# EAGLE board core+io4 (EAGLE 6.6.0), part 1 of 2
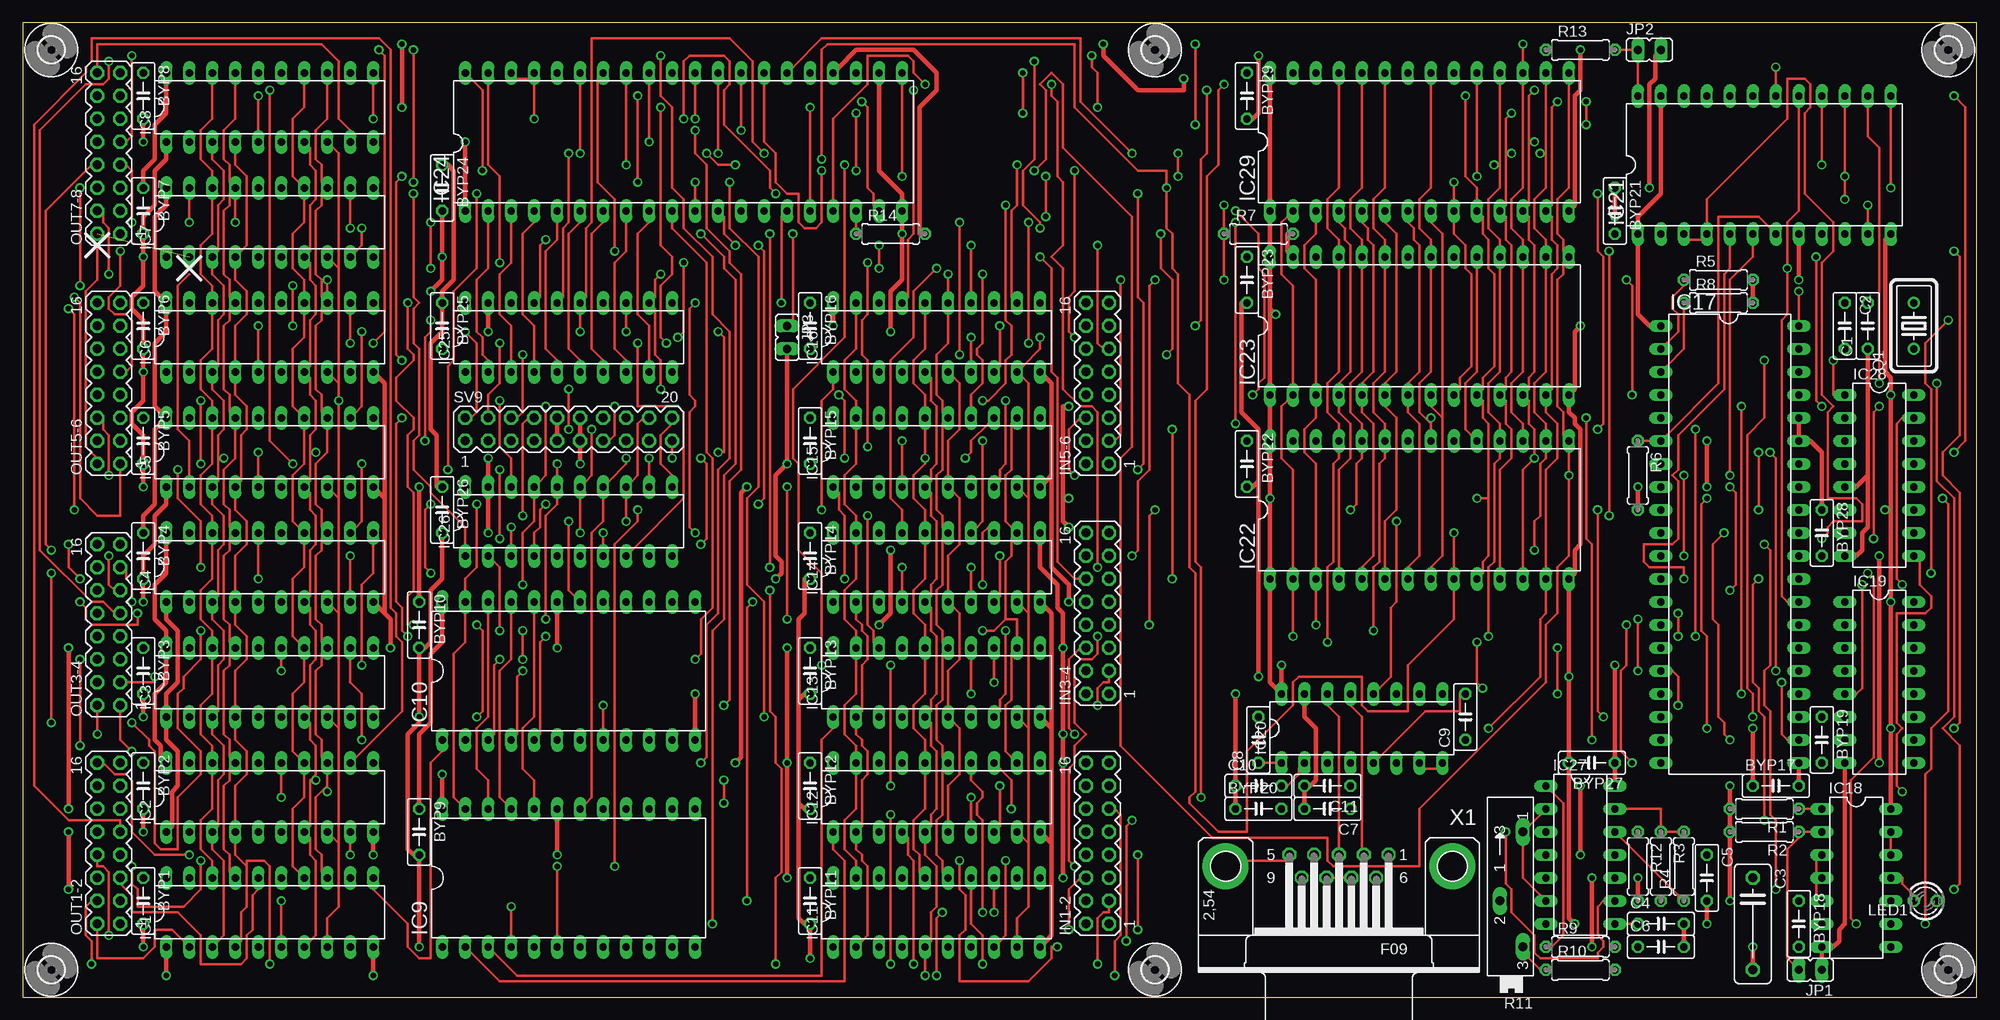
[diagram p3: board, top side]
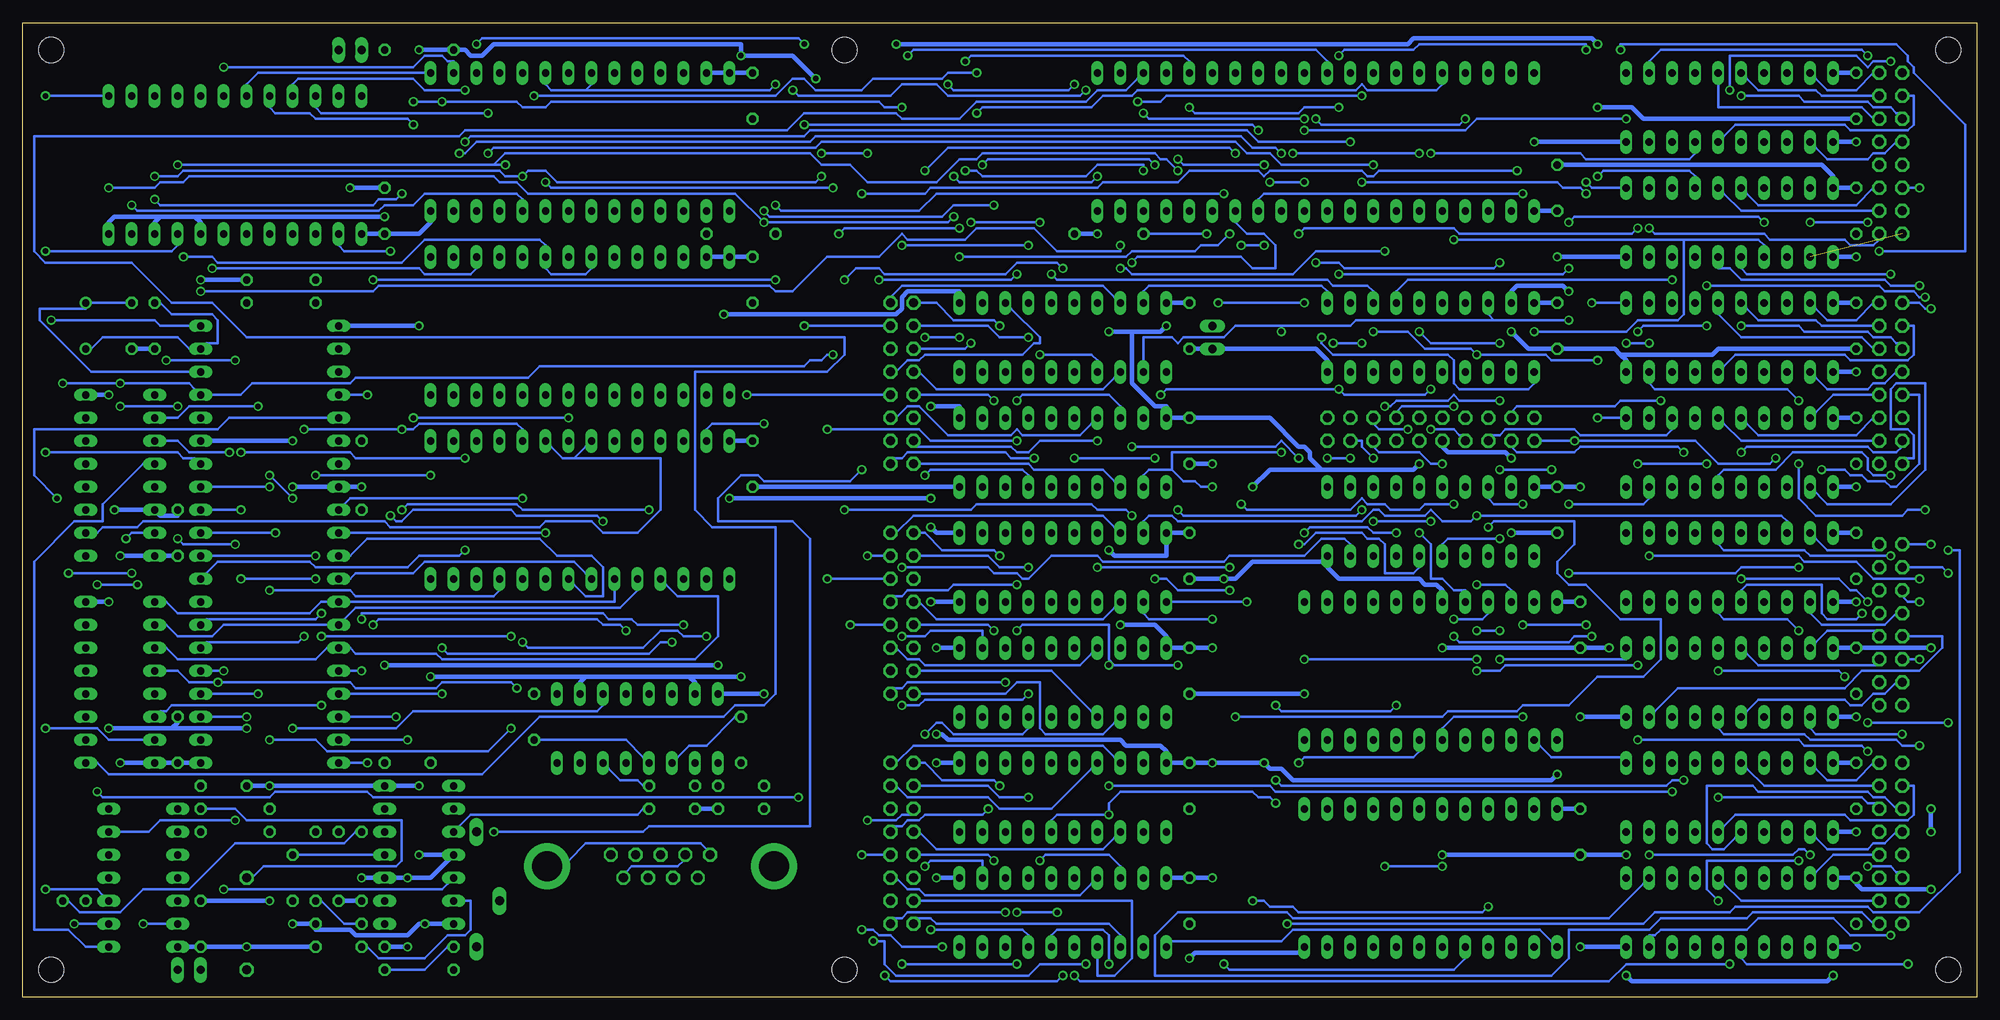
[diagram p4: board, bottom side, seen from below]

Size 215.88 x 107.62 mm. Coordinates in mm from the lower left corner, seen from the top.
Outline: 0,0 215.88,0 215.88,107.62 0,107.62 0,0
Copper layers (1*16): Top 0.035mm / dielectric 1.5mm / Bottom 0.035mm
Design rules "default": minimum track width 10mil, minimum drill 24mil, track to track 8mil, track to pad 8mil, pad to pad 8mil, via to via 8mil, smd to smd 8mil, copper to edge 40mil, drill to drill 8mil, minimum pad ring 10mil, minimum via ring 8mil, stop-mask expansion 4mil, vias tented up to drill 0mil, thermal gap 10mil
Net classes: 1 Power: width 0.508 mm, drill 0.254 mm, clearance 0.254 mm

## Footprints (pad centres in the part's own frame; a part is rotated, then mirrored left to right if it is on the bottom)
C050-025X075 = drill 0.813 octagon: 1 -2.54,0; 2 2.54,0
C102-043X133 = drill 1.016 octagon: 1 -5.08,0; 2 5.08,0
DIL20 = drill 0.813 long: 1 -11.43,-3.81; 2 -8.89,-3.81; 3 -6.35,-3.81; 4 -3.81,-3.81; 5 -1.27,-3.81; 6 1.27,-3.81; 7 3.81,-3.81; 8 6.35,-3.81; 9 8.89,-3.81; 10 11.43,-3.81; 11 11.43,3.81; 12 8.89,3.81; 13 6.35,3.81; 14 3.81,3.81; 15 1.27,3.81; 16 -1.27,3.81; 17 -3.81,3.81; 18 -6.35,3.81; 19 -8.89,3.81; 20 -11.43,3.81
DIL24-6 = drill 0.813 long: 1 -13.97,-7.62; 2 -11.43,-7.62; 3 -8.89,-7.62; 4 -6.35,-7.62; 5 -3.81,-7.62; 6 -1.27,-7.62; 7 1.27,-7.62; 8 3.81,-7.62; 9 6.35,-7.62; 10 8.89,-7.62; 11 11.43,-7.62; 12 13.97,-7.62; 13 13.97,7.62; 14 11.43,7.62; 15 8.89,7.62; 16 6.35,7.62; 17 3.81,7.62; 18 1.27,7.62; 19 -1.27,7.62; 20 -3.81,7.62; 21 -6.35,7.62; 22 -8.89,7.62; 23 -11.43,7.62; 24 -13.97,7.62
DIL40 = drill 0.813 long: 1 -24.13,-7.62; 2 -21.59,-7.62; 3 -19.05,-7.62; 4 -16.51,-7.62; 5 -13.97,-7.62; 6 -11.43,-7.62; 7 -8.89,-7.62; 8 -6.35,-7.62; 9 -3.81,-7.62; 10 -1.27,-7.62; 11 1.27,-7.62; 12 3.81,-7.62; 13 6.35,-7.62; 14 8.89,-7.62; 15 11.43,-7.62; 16 13.97,-7.62; 17 16.51,-7.62; 18 19.05,-7.62; 19 21.59,-7.62; 20 24.13,-7.62; 21 24.13,7.62; 22 21.59,7.62; 23 19.05,7.62; 24 16.51,7.62; 25 13.97,7.62; 26 11.43,7.62; 27 8.89,7.62; 28 6.35,7.62; 29 3.81,7.62; 30 1.27,7.62; 31 -1.27,7.62; 32 -3.81,7.62; 33 -6.35,7.62; 34 -8.89,7.62; 35 -11.43,7.62; 36 -13.97,7.62; 37 -16.51,7.62; 38 -19.05,7.62; 39 -21.59,7.62; 40 -24.13,7.62
DIL14 = drill 0.813 long: 1 -7.62,-3.81; 2 -5.08,-3.81; 3 -2.54,-3.81; 4 0,-3.81; 5 2.54,-3.81; 6 5.08,-3.81; 7 7.62,-3.81; 8 7.62,3.81; 9 5.08,3.81; 10 2.54,3.81; 11 0,3.81; 12 -2.54,3.81; 13 -5.08,3.81; 14 -7.62,3.81
DIL16 = drill 0.813 long: 1 -8.89,-3.81; 2 -6.35,-3.81; 3 -3.81,-3.81; 4 -1.27,-3.81; 5 1.27,-3.81; 6 3.81,-3.81; 7 6.35,-3.81; 8 8.89,-3.81; 9 8.89,3.81; 10 6.35,3.81; 11 3.81,3.81; 12 1.27,3.81; 13 -1.27,3.81; 14 -3.81,3.81; 15 -6.35,3.81; 16 -8.89,3.81
DIL24 = drill 0.813 long: 1 -13.97,-7.62; 2 -11.43,-7.62; 3 -8.89,-7.62; 4 -6.35,-7.62; 5 -3.81,-7.62; 6 -1.27,-7.62; 7 1.27,-7.62; 8 3.81,-7.62; 9 6.35,-7.62; 10 8.89,-7.62; 11 11.43,-7.62; 12 13.97,-7.62; 13 13.97,7.62; 14 11.43,7.62; 15 8.89,7.62; 16 6.35,7.62; 17 3.81,7.62; 18 1.27,7.62; 19 -1.27,7.62; 20 -3.81,7.62; 21 -6.35,7.62; 22 -8.89,7.62; 23 -11.43,7.62; 24 -13.97,7.62
DIL28 = drill 0.813 long: 1 -16.51,-7.62; 2 -13.97,-7.62; 3 -11.43,-7.62; 4 -8.89,-7.62; 5 -6.35,-7.62; 6 -3.81,-7.62; 7 -1.27,-7.62; 8 1.27,-7.62; 9 3.81,-7.62; 10 6.35,-7.62; 11 8.89,-7.62; 12 11.43,-7.62; 13 13.97,-7.62; 14 16.51,-7.62; 15 16.51,7.62; 16 13.97,7.62; 17 11.43,7.62; 18 8.89,7.62; 19 6.35,7.62; 20 3.81,7.62; 21 1.27,7.62; 22 -1.27,7.62; 23 -3.81,7.62; 24 -6.35,7.62; 25 -8.89,7.62; 26 -11.43,7.62; 27 -13.97,7.62; 28 -16.51,7.62
MA08-2 = drill 1.016 octagon: 1 -8.89,-1.27; 2 -8.89,1.27; 3 -6.35,-1.27; 4 -6.35,1.27; 5 -3.81,-1.27; 6 -3.81,1.27; 7 -1.27,-1.27; 8 -1.27,1.27; 9 1.27,-1.27; 10 1.27,1.27; 11 3.81,-1.27; 12 3.81,1.27; 13 6.35,-1.27; 14 6.35,1.27; 15 8.89,-1.27; 16 8.89,1.27
JP1 = drill 0.914 long: 1 0,-1.27; 2 0,1.27
LED3MM = drill 0.813 octagon: A -1.27,0; K 1.27,0
HC18U-V = drill 0.813: 1 -2.54,0; 2 2.54,0
0207/7 = drill 0.813 octagon: 1 -3.81,0; 2 3.81,0
SP19L = drill 1.016 long: A 5.715,-1.27; E -6.985,-1.27; S -1.905,1.27
MA10-2 = drill 1.016 octagon: 1 -11.43,-1.27; 2 -11.43,1.27; 3 -8.89,-1.27; 4 -8.89,1.27; 5 -6.35,-1.27; 6 -6.35,1.27; 7 -3.81,-1.27; 8 -3.81,1.27; 9 -1.27,-1.27; 10 -1.27,1.27; 11 1.27,-1.27; 12 1.27,1.27; 13 3.81,-1.27; 14 3.81,1.27; 15 6.35,-1.27; 16 6.35,1.27; 17 8.89,-1.27; 18 8.89,1.27; 19 11.43,-1.27; 20 11.43,1.27
2,8 = hole 2.8: 0,0
F09HP = drill 1.016 octagon: 1 -5.486,-1.27; 2 -2.743,-1.27; 3 0,-1.27; 4 2.743,-1.27; 5 5.486,-1.27; 6 -4.115,1.27; 7 -1.372,1.27; 8 1.372,1.27; 9 4.115,1.27 | drill 3.302 pad 5.08: G1 -12.522,0; G2 12.522,0

## Placement (x,y rotation side)
BYP1  .01uf  [C050-025X075]  13.33,10.63 270 top
BYP2  .01uf  [C050-025X075]  13.33,23.33 270 top
BYP3  .01uf  [C050-025X075]  13.33,36.03 270 top
BYP4  .01uf  [C050-025X075]  13.33,48.73 270 top
BYP5  .01uf  [C050-025X075]  13.33,61.43 270 top
BYP6  .01uf  [C050-025X075]  13.33,74.13 270 top
BYP7  .01uf  [C050-025X075]  13.33,86.83 270 top
BYP8  .01uf  [C050-025X075]  13.33,99.53 270 top
BYP9  .01uf  [C050-025X075]  43.81,18.25 270 top
BYP10  .01uf  [C050-025X075]  43.81,41.11 270 top
BYP11  .01uf  [C050-025X075]  86.99,10.63 270 top
BYP12  .01uf  [C050-025X075]  86.99,23.33 270 top
BYP13  .01uf  [C050-025X075]  86.99,36.03 270 top
BYP14  .01uf  [C050-025X075]  86.99,48.73 270 top
BYP15  .01uf  [C050-025X075]  86.99,61.43 270 top
BYP16  .01uf  [C050-025X075]  86.99,74.13 270 top
BYP17  .01uf  [C050-025X075]  193.67,23.33 0 top
BYP18  .01uf  [C050-025X075]  196.21,8.09 270 top
BYP19  .01uf  [C050-025X075]  198.75,28.41 270 top
BYP20  .01uf  [C050-025X075]  136.52,20.79 0 top
BYP21  .01uf  [C050-025X075]  175.89,86.83 270 top
BYP22  .01uf  [C050-025X075]  135.25,58.89 270 top
BYP23  .01uf  [C050-025X075]  135.25,79.21 270 top
BYP24  .01uf  [C050-025X075]  46.35,89.37 270 top
BYP25  .01uf  [C050-025X075]  46.35,74.13 270 top
BYP26  .01uf  [C050-025X075]  46.35,53.81 270 top
BYP27  .01uf  [C050-025X075]  173.35,25.87 180 top
BYP28  .01uf  [C050-025X075]  198.75,51.27 270 top
BYP29  .01uf  [C050-025X075]  135.25,99.53 270 top
C1  27pf  [C050-025X075]  203.83,74.13 90 top
C2  27pf  [C050-025X075]  201.29,74.13 270 top
C3  22uf  [C102-043X133]  191.13,8.09 270 top
C4  0.1uf  [C050-025X075]  180.97,8.09 0 top
C5  10uf  [C050-025X075]  186.05,13.17 270 top
C6  330pf  [C050-025X075]  180.97,5.55 0 top
C7  10uf  [C050-025X075]  144.14,20.79 180 top
C8  0.1uf  [C050-025X075]  136.52,28.41 90 top
C9  0.1uf  [C050-025X075]  159.38,30.95 90 top
C10  0.1uf  [C050-025X075]  136.52,23.33 0 top
C11  0.1uf  [C050-025X075]  144.14,23.33 180 top
IC1  74LS374N  [DIL20]  27.3,9.36 0 top
IC2  74LS374N  [DIL20]  27.3,22.06 0 top
IC3  74LS374N  [DIL20]  27.3,34.76 0 top
IC4  74LS374N  [DIL20]  27.3,47.46 0 top
IC5  74LS374N  [DIL20]  27.3,60.16 0 top
IC6  74LS374N  [DIL20]  27.3,72.86 0 top
IC7  74LS374N  [DIL20]  27.3,85.56 0 top
IC8  74LS374N  [DIL20]  27.3,98.26 0 top
IC9  74154N  [DIL24-6]  60.32,13.17 0 top
IC10  74154N  [DIL24-6]  60.32,36.03 0 top
IC11  74LS373N  [DIL20]  100.96,9.36 0 top
IC12  74LS373N  [DIL20]  100.96,22.06 0 top
IC13  74LS373N  [DIL20]  100.96,34.76 0 top
IC14  74LS373N  [DIL20]  100.96,47.46 0 top
IC15  74LS373N  [DIL20]  100.96,60.16 0 top
IC16  74LS373N  [DIL20]  100.96,72.86 0 top
IC17  [DIL40]  188.59,50 270 top
IC18  74LS00N  [DIL14]  202.56,13.17 270 top
IC19  74LS138N  [DIL16]  205.1,34.76 270 top
IC20  MAX232  [DIL16]  147.95,29.68 0 top
IC21  [DIL24]  192.4,91.91 0 top
IC22  5565  [DIL28]  154.3,53.81 0 top
IC23  2764  [DIL28]  154.3,74.13 0 top
IC24  [DIL40]  73.02,94.45 0 top
IC25  74LS245N  [DIL20]  60.32,72.86 0 top
IC26  74LS245N  [DIL20]  60.32,52.54 0 top
IC27  LM556N  [DIL14]  172.08,15.71 270 top
IC28  74LS138N  [DIL16]  205.1,57.62 270 top
IC29  2764  [DIL28]  154.3,94.45 0 top
IN1-2  [MA08-2]  118.74,16.98 90 top
IN3-4  [MA08-2]  118.74,42.38 90 top
IN5-6  [MA08-2]  118.74,67.78 90 top
JP1  RESET  [JP1]  197.48,3.01 90 top
JP2  DEBUG  [JP1]  179.7,104.61 270 top
JP3  CB1  [JP1]  84.45,72.86 180 top
LED1  [LED3MM]  210.18,10.63 180 top
OUT1-2  [MA08-2]  9.52,16.98 90 top
OUT3-4  [MA08-2]  9.52,41.11 90 top
OUT5-6  [MA08-2]  9.52,67.78 90 top
OUT7-8  [MA08-2]  9.52,93.18 90 top
Q1  4Mhz  [HC18U-V]  208.91,74.13 90 top
R1  10K  [0207/7]  192.4,20.79 180 top
R2  10K  [0207/7]  192.4,18.25 180 top
R3  100K  [0207/7]  180.97,14.44 270 top
R4  100K  [0207/7]  183.51,14.44 90 top
R5  3.3K  [0207/7]  187.32,79.21 0 top
R6  3.3K  [0207/7]  178.43,57.62 270 top
R7  3.3K  [0207/7]  136.52,84.29 0 top
R8  3.3K  [0207/7]  187.32,76.67 0 top
R9  1.8K  [0207/7]  172.08,5.55 0 top
R10  10K  [0207/7]  172.08,3.01 0 top
R11  10K  [SP19L]  164.46,12.54 90 top
R12  270  [0207/7]  178.43,14.44 270 top
R13  1K  [0207/7]  172.08,104.61 0 top
R14  3.3K  [0207/7]  95.88,84.29 0 top
SV9  [MA10-2]  60.32,62.7 0 top
U$1  [2,8]  125.09,3.01 0 top
U$2  [2,8]  125.09,104.61 0 top
U$3  [2,8]  3.17,104.61 0 top
U$4  [2,8]  3.17,3.01 0 top
U$5  [2,8]  212.72,104.61 0 top
U$6  [2,8]  212.72,3.01 0 top
X1  [F09HP]  145.41,14.44 180 top

## Tracks (layer width: path | path; a pad name or v marks a point on that pad's centre or on a via)
!AB
  Bottom 0.254: 154.94,59.52 153.66,60.8 IC22.22 | 154.94,59.52 156.2,59.52 157.47,60.8 IC22.20 | 154.94,59.52 145.41,59.52 145.41,53.81 147.95,51.27 151.76,51.27 153.03,52.54 158.11,52.54 158.75,51.91 175.25,51.91 175.89,52.54 202.56,52.54 203.19,51.91 207,51.91 207.64,51.27 IC28.10
!CD  (via drill 0.61)
  Top 0.254: v207.64,22.7 207,23.33 207,29.04 207.64,29.68 207,30.31 207,42.38 210.18,42.38 210.81,43.02 210.81,44.28 209.54,45.55 209.54,48.09 IC28.9 | v130.17,22.06 130.17,47.46 129.53,48.09 129.53,65.88 130.81,67.14 130.81,90.64 132.07,91.91 132.07,100.16 v132.71,100.8
  Bottom 0.254: 153.66,100.16 157.47,100.16 158.11,100.8 IC29.20 | 153.66,100.16 153.03,100.8 IC29.22 | v207.64,22.7 207,22.06 188.59,22.06 187.95,22.7 177.79,22.7 177.16,22.06 v130.17,22.06 | v132.71,100.8 133.34,100.16 153.66,100.16
!EF  (via drill 0.61)
  Top 0.254: v204.47,50.63 204.47,64.61 v205.1,65.24 | v198.75,65.24 198.12,65.88 v198.12,81.75
  Bottom 0.254: IC23.22 153.03,80.48 153.66,79.84 157.47,79.84 158.11,80.48 IC23.20 158.11,83.02 158.75,83.66 171.44,83.66 173.98,81.11 194.31,81.11 194.94,81.75 v198.12,81.75 | v204.47,50.63 203.83,51.27 202.56,51.27 IC28.7 | v205.1,65.24 v198.75,65.24
!HLT
  Top 0.254: IC17.2 181.6,72.22 182.88,73.5 182.88,75.4 182.24,76.03 182.24,77.3 183.51,78.58 R5.1
!IO-E
  Bottom 0.254: IC19.9 207.64,25.87 206.37,24.6 165.09,24.6 158.75,30.95 138.42,30.95 137.16,32.22 133.98,32.22 132.71,33.49 132.71,51.91 139.69,51.91 141.6,53.81 141.6,69.05 126.99,69.05 125.09,70.95 125.09,72.86 191.13,72.86 194.94,76.67 199.38,76.67 203.83,81.11 213.35,81.11 214.62,82.39 214.62,95.08 167.63,95.08 167,95.72 131.44,95.72 129.53,97.62 119.38,97.62 118.74,96.99 112.39,96.99 110.48,98.89 98.42,98.89 97.15,100.16 93.97,100.16 92.7,101.44 IC24.23
!IO-F  (via drill 0.61)
  Top 0.254: v213.35,82.39 213.99,81.75 213.99,62.06 212.09,60.16 212.09,57.62 213.99,55.71 213.99,30.31 v213.35,29.68
  Bottom 0.254: v213.35,82.39 199.38,82.39 198.75,83.02 IC21.9 | v213.35,29.68 207.64,29.68 206.37,28.41 202.56,28.41 IC19.7
!IRQ  (via drill 0.61)
  Top 0.254: IC24.38 54.61,101.44 55.88,101.44 IC24.37 56.51,100.8 v56.51,96.99 | v132.71,79.21 132.71,83.66 R7.1 132.71,84.92 v132.71,87.47 | v177.16,79.21 177.79,78.58 v177.79,66.51 | v73.02,96.99 73.02,103.34 73.66,103.97 77.46,103.97 78.1,103.34 78.1,100.8 77.46,100.16 77.46,96.36 82.55,91.28 82.55,89.37 v83.18,88.73
  Bottom 0.254: v177.16,79.21 v132.71,79.21 | v177.79,66.51 179.7,66.51 IC17.4 | v56.51,96.99 57.15,96.36 72.38,96.36 v73.02,96.99 | v83.18,88.73 114.93,88.73 116.83,86.83 132.07,86.83 v132.71,87.47
!NMI
  Top 0.254: R6.1 179.06,61.43 179.7,61.43 IC17.6 181.6,62.06 187.32,67.78 187.32,86.19 191.76,86.19 193.03,84.92 IC21.7
!RST  (via drill 0.61)
  Top 0.254: v212.72,74.77 210.18,72.22 210.18,67.78 210.81,67.14 v210.81,46.82 | v203.83,46.82 204.47,46.19 204.47,26.5 201.92,23.96 201.92,8.73 v202.56,8.09 | v65.4,82.39 65.4,88.1 63.5,90 63.5,101.44 IC24.34 | v94.61,83.02 v94.61,80.48 | v196.21,77.94 196.21,74.77 IC17.40
  Bottom 0.254: v212.72,74.77 201.29,74.77 200.66,74.13 197.48,74.13 IC17.40 | v210.81,46.82 v203.83,46.82 | v202.56,8.09 200.02,8.09 IC18.6 | v65.4,82.39 73.02,82.39 75.56,79.84 93.34,79.84 93.97,80.48 v94.61,80.48 | v94.61,83.02 94.61,82.39 101.59,82.39 104.13,84.92 110.48,84.92 111.75,83.66 118.1,83.66 118.74,84.29 121.28,81.75 126.99,81.75 130.81,77.94 132.71,77.94 133.34,78.58 176.53,78.58 177.16,77.94 v196.21,77.94
A00  (via drill 0.61)
  Top 0.254: 161.92,55.08 161.92,63.34 161.28,63.97 161.28,65.88 IC23.10 161.28,67.14 161.28,68.41 162.56,69.69 162.56,79.84 161.92,80.48 161.92,83.66 161.28,84.29 161.28,86.19 IC29.10 160.65,88.1 160.65,89.37 159.38,90.64 v159.38,99.53 | 161.92,55.08 161.92,48.73 161.28,48.09 161.28,46.82 IC22.10 | 161.92,55.08 v160.65,55.08 | v203.83,87.47 203.83,85.56 IC21.11 | v110.48,102.07 v110.48,97.62
  Bottom 0.254: v160.65,55.08 179.7,55.08 180.34,54.45 IC17.9 | v203.83,87.47 203.19,86.83 176.53,86.83 175.89,87.47 172.72,87.47 171.44,88.73 161.28,88.73 160.65,88.1 IC29.10 | v110.48,97.62 109.85,98.26 97.78,98.26 96.52,99.53 93.34,99.53 92.7,100.16 68.57,100.16 67.94,100.8 67.3,100.16 59.69,100.16 59.05,100.8 IC24.36 | v110.48,102.07 113.66,102.07 114.3,101.44 121.91,101.44 123.19,100.16 128.27,100.16 129.53,101.44 130.81,101.44 132.71,99.53 v159.38,99.53
A01  (via drill 0.61)
  Top 0.254: IC23.9 158.75,67.14 158.75,68.41 160.01,69.69 160.01,79.84 159.38,80.48 159.38,83.02 158.11,84.29 158.11,85.56 IC29.9 158.11,88.1 v158.11,90 | v158.11,51.27 158.11,47.46 IC22.9 158.11,44.92 158.11,41.74 153.03,36.66 153.03,31.58 148.59,31.58 147.95,32.22 147.95,35.39 140.97,35.39 140.33,34.76 140.33,32.22 135.25,27.14 135.25,18.25 132.07,18.25 128.9,21.42 128.9,22.06 129.53,22.7 129.53,46.82 128.9,47.46 128.9,66.51 127.63,67.78 127.63,79.84 126.99,80.48 126.99,84.29 126.36,84.92 v126.36,89.37 126.36,91.28 123.19,91.28 116.2,98.26 116.2,105.25 88.89,105.25 88.26,104.61 v88.26,92.55 | v61.59,93.18 61.59,100.8 IC24.35 | v75.56,93.18 76.83,91.91 v78.73,91.91
  Bottom 0.254: v158.11,51.27 179.7,51.27 IC17.10 | v75.56,93.18 v61.59,93.18 | v78.73,91.91 87.62,91.91 v88.26,92.55 | v158.11,90 157.47,89.37 v126.36,89.37
A02
  Top 0.254: 156.84,63.97 156.84,48.73 155.57,47.46 IC22.8 | 156.84,63.97 155.57,65.24 IC23.8 | 156.84,63.97 156.84,84.29 155.57,85.56 IC29.8
  Bottom 0.254: IC17.11 179.7,48.73 177.79,50.63 158.75,50.63 156.84,48.73 153.03,48.73 151.76,47.46 151.76,44.28 153.66,44.28 154.94,45.55 IC22.8
A03
  Top 0.254: IC22.7 153.03,47.46 154.3,48.73 154.3,63.34 153.03,64.61 153.03,65.24 IC23.7 153.03,67.78 154.3,69.05 154.3,83.02 153.66,83.66 153.66,84.92 153.03,85.56 IC29.7
  Bottom 0.254: IC17.12 179.7,46.19 179.06,46.82 172.72,46.82 171.44,48.09 154.94,48.09 153.66,46.82 IC22.7
A04
  Top 0.254: IC29.6 150.49,85.56 151.76,84.29 151.76,69.05 150.49,67.78 IC23.6 150.49,65.24 151.76,63.97 151.76,53.81 150.49,52.54 150.49,47.46 IC22.6
  Bottom 0.254: IC22.6 150.49,44.92 150.49,43.65 179.7,43.65 IC17.13 182.24,43.65 182.88,43.65 184.14,42.38 198.75,42.38 200.02,43.65 IC19.1
A05
  Top 0.254: IC22.5 147.95,47.46 149.22,48.73 149.22,63.34 147.95,64.61 147.95,65.24 IC23.5 147.95,67.78 149.22,69.05 149.22,83.02 148.59,83.66 148.59,84.92 147.95,85.56 IC29.5
  Bottom 0.254: IC19.2 200.02,41.11 198.75,39.84 194.94,39.84 193.67,41.11 182.24,41.11 IC17.14 180.34,41.74 179.06,43.02 149.85,43.02 147.95,44.92 IC22.5
A06
  Top 0.254: IC22.4 145.41,47.46 145.41,58.25 146.68,59.52 146.68,63.34 145.41,64.61 145.41,65.24 IC23.4 145.41,67.78 146.68,69.05 146.68,83.02 146.04,83.66 146.04,84.92 145.41,85.56 IC29.4
  Bottom 0.254: IC19.3 200.02,38.57 198.75,37.3 183.51,37.3 182.24,38.57 IC17.15 179.7,38.57 179.06,37.94 170.17,37.94 169.54,37.3 141.6,37.3 139.06,39.84 139.06,44.28 143.5,44.28 144.78,45.55 IC22.4
A07  (via drill 0.61)
  Top 0.254: v182.88,32.22 182.88,35.39 182.24,36.03 IC17.16 | IC29.3 142.87,85.56 142.87,84.29 141.6,83.02 141.6,80.48 142.87,79.21 142.87,67.78 IC23.3 142.87,65.24 142.87,63.97 141.6,62.7 141.6,60.16 142.87,58.89 142.87,47.46 IC22.3 142.87,44.92 v142.87,41.11 | v178.43,41.74 v178.43,36.03
  Bottom 0.254: v182.88,32.22 199.38,32.22 200.02,31.58 200.66,31.58 IC19.6 | v178.43,36.03 179.7,36.03 IC17.16 | v178.43,41.74 178.43,42.38 151.76,42.38 151.12,41.74 148.59,41.74 147.95,41.11 v142.87,41.11
A08  (via drill 0.61)
  Top 0.254: IC29.25 145.41,100.8 145.41,89.37 144.14,88.1 144.14,84.92 145.41,83.66 145.41,83.02 IC23.25 145.41,80.48 145.41,69.05 144.14,67.78 144.14,64.61 145.41,63.34 145.41,62.7 IC22.25 145.41,60.16 145.41,59.52 144.78,58.89 144.78,48.09 144.14,47.46 v144.14,39.2 | v169.54,38.57 v169.54,33.49
  Bottom 0.254: v169.54,33.49 179.7,33.49 IC17.17 | v169.54,38.57 168.91,37.94 146.68,37.94 145.41,39.2 v144.14,39.2
A09  (via drill 0.61)
  Top 0.254: IC29.24 147.95,100.8 147.95,89.37 146.68,88.1 146.68,84.92 147.95,83.66 147.95,83.02 IC23.24 147.95,80.48 147.95,69.05 146.68,67.78 146.68,64.61 147.95,63.34 147.95,62.7 IC22.24 147.95,60.16 147.95,59.52 147.31,58.89 147.31,54.45 v146.68,53.81 | v174.62,30.95 173.98,31.58 v173.98,53.81
  Bottom 0.254: v174.62,30.95 179.7,30.95 IC17.18 | v173.98,53.81 173.35,54.45 161.28,54.45 160.65,53.81 v146.68,53.81
A10  (via drill 0.61)
  Top 0.254: 155.57,63.34 154.3,64.61 154.3,67.78 155.57,69.05 155.57,80.48 IC23.21 155.57,83.02 155.57,83.66 154.3,84.92 154.3,88.1 155.57,89.37 155.57,100.8 IC29.21 | 155.57,63.34 155.57,62.7 IC22.21 | v173.35,28.41 173.35,50 172.72,50.63 v172.72,63.97 | 155.57,63.34 v155.57,63.97
  Bottom 0.254: v173.35,28.41 179.7,28.41 IC17.19 | v155.57,63.97 v172.72,63.97
A11  (via drill 0.61)
  Top 0.254: IC29.23 150.49,100.8 150.49,89.37 149.22,88.1 149.22,84.92 150.49,83.66 150.49,83.02 IC23.23 150.49,80.48 150.49,69.05 149.22,67.78 149.22,64.61 150.49,63.34 150.49,62.7 IC22.23 150.49,60.16 150.49,59.52 149.85,58.89 149.85,48.09 149.22,47.46 v149.22,40.48 | v177.79,25.87 176.53,27.14 176.53,36.03 177.16,36.66 v177.16,41.11
  Bottom 0.254: v177.79,25.87 179.7,25.87 IC17.20 | v177.16,41.11 176.53,41.74 152.39,41.74 151.76,41.11 149.85,41.11 v149.22,40.48
A12  (via drill 0.61)
  Top 0.254: v194.31,34.76 194.31,29.04 194.94,28.41 IC17.22 | IC29.2 139.69,86.19 139.06,85.56 139.06,79.84 140.33,78.58 140.33,67.78 IC23.2 139.69,65.88 139.06,65.24 139.06,59.52 140.33,58.25 140.33,47.46 IC22.2 140.33,44.92 v140.33,39.84 | v161.28,34.12 160.65,34.76 v160.65,39.2
  Bottom 0.254: IC19.4 200.02,36.03 198.75,36.03 197.48,34.76 v194.31,34.76 179.7,34.76 179.06,34.12 170.17,34.12 169.54,34.76 161.92,34.76 v161.28,34.12 | v160.65,39.2 160.01,38.57 147.31,38.57 145.41,40.48 143.5,40.48 142.87,39.84 v140.33,39.84
A13  (via drill 0.61)
  Top 0.254: v191.13,30.95 191.13,33.49 190.5,34.12 190.5,62.06 192.4,63.97 v192.4,70.32 | v200.02,70.32 200.02,66.51 IC28.1
  Bottom 0.254: v191.13,30.95 194.94,30.95 IC17.23 | v192.4,70.32 v200.02,70.32
A14  (via drill 0.61)
  Top 0.254: v189.86,65.24 v189.86,33.49
  Bottom 0.254: v189.86,33.49 194.94,33.49 IC17.24 | v189.86,65.24 197.48,65.24 198.75,63.97 200.02,63.97 IC28.2
A15  (via drill 0.61)
  Top 0.254: v193.67,36.03 193.67,59.52 v193.03,60.16
  Bottom 0.254: v193.67,36.03 194.94,36.03 IC17.25 | v193.03,60.16 197.48,60.16 198.75,61.43 200.02,61.43 IC28.3
CB1  (via drill 0.61)
  Top 0.254: IC24.18 92.07,85.56 92.07,84.92 R14.1 | v85.08,84.29 85.08,74.77 JP3.1
  Bottom 0.254: v85.08,84.29 91.44,84.29 R14.1
D0  (via drill 0.61)
  Top 0.254: IC22.11 163.19,47.46 163.19,58.25 164.46,59.52 164.46,62.7 163.82,63.34 163.82,65.88 IC23.11 163.82,67.14 163.82,68.41 164.46,69.05 164.46,83.02 163.82,83.66 163.82,86.19 IC29.11 163.82,87.47 163.82,93.18 | v164.46,97.62 163.82,96.99 163.82,93.18 | v66.67,91.91 66.67,100.8 IC24.33 | v164.46,93.18 163.82,93.18 | v188.59,56.35 189.22,55.71 189.22,45.55 v188.59,44.92
  Bottom 0.254: v164.46,97.62 182.88,97.62 183.51,98.26 IC21.22 | v66.67,91.91 76.83,91.91 78.1,93.18 80.64,93.18 81.91,94.45 127.63,94.45 128.27,93.81 163.82,93.81 v164.46,93.18 | v188.59,56.35 194.94,56.35 IC17.33 | v188.59,44.92 179.7,44.92 179.06,44.28 163.82,44.28 163.19,44.92 IC22.11
D1  (via drill 0.61)
  Top 0.254: IC22.12 165.73,47.46 165.73,58.25 v167,59.52 167,62.7 166.37,63.34 166.37,65.88 IC23.12 166.37,67.14 166.37,68.41 167,69.05 167,83.02 166.37,83.66 166.37,86.19 IC29.12 166.37,87.47 166.37,94.45 | v167,100.16 166.37,99.53 166.37,94.45 | v69.21,94.45 69.21,100.8 IC24.32 | v167,94.45 166.37,94.45 | v191.76,60.16 v191.76,53.81
  Bottom 0.254: v167,100.16 171.44,100.16 172.72,101.44 185.41,101.44 186.05,100.8 IC21.21 | v69.21,94.45 79.37,94.45 80.64,95.72 128.9,95.72 129.53,95.08 166.37,95.08 v167,94.45 | v191.76,53.81 194.94,53.81 IC17.32 | v191.76,60.16 179.7,60.16 179.06,59.52 v167,59.52
D2  (via drill 0.61)
  Top 0.254: v172.72,98.89 v172.72,96.36 | v169.54,98.89 168.91,98.26 168.91,87.47 IC29.13 168.91,86.19 168.91,83.66 169.54,83.02 169.54,80.48 168.91,79.84 168.91,67.14 IC23.13 168.27,65.24 168.27,64.61 169.54,63.34 169.54,59.52 168.27,58.25 168.27,47.46 IC22.13 168.27,44.92 168.27,42.38 167.63,41.74 167.63,35.39 v161.92,29.68 | v118.1,103.97 118.1,102.7 118.74,102.07 v118.74,98.26 | v187.95,51.27 186.69,50 186.69,41.74 187.32,41.11 187.32,30.95 187.95,30.31 187.95,29.04 v188.59,28.41
  Bottom 0.254: v172.72,96.36 173.35,96.99 183.51,96.99 184.14,97.62 187.95,97.62 188.59,98.26 IC21.20 | v172.72,98.89 v169.54,98.89 161.28,98.89 160.65,98.26 158.11,98.26 157.47,98.89 121.28,98.89 120.64,98.26 v118.74,98.26 | v118.1,103.97 117.47,104.61 73.02,104.61 71.75,103.34 IC24.31 | v187.95,51.27 194.94,51.27 IC17.31 | v188.59,28.41 183.51,28.41 182.24,27.14 164.46,27.14 v161.92,29.68
D3  (via drill 0.61)
  Top 0.254: v74.29,96.99 74.29,100.8 IC24.30 | v92.07,91.28 v92.07,97.62 | v111.75,91.28 113.02,92.55 113.02,100.16 112.39,100.8 113.66,102.07 114.93,100.8 114.93,93.81 122.55,86.19 122.55,60.8 121.28,59.52 121.28,27.77 131.44,17.61 144.14,17.61 144.14,15.08 144.78,14.44 154.3,14.44 154.3,20.79 168.27,34.76 168.27,41.11 169.54,42.38 169.54,47.46 170.81,48.73 v170.81,57.62 170.81,60.16 IC22.15 170.17,62.06 170.17,64.61 169.54,65.24 169.54,79.21 170.17,79.84 170.17,81.11 IC23.15 170.17,82.39 170.17,83.66 169.54,84.29 169.54,88.1 170.81,89.37 170.81,100.8 IC29.15 | v183.51,57.62 v183.51,48.73
  Bottom 0.254: IC29.15 171.44,102.07 189.86,102.07 191.13,100.8 IC21.19 | v74.29,96.99 91.44,96.99 v92.07,97.62 | v92.07,91.28 92.07,91.91 97.15,91.91 98.42,90.64 109.85,90.64 110.48,91.28 v111.75,91.28 | v183.51,48.73 194.94,48.73 IC17.30 | v170.81,57.62 v183.51,57.62
D4  (via drill 0.61)
  Top 0.254: 168.27,93.18 168.27,89.37 167,88.1 167,84.92 168.27,83.66 168.27,83.02 IC23.16 168.27,80.48 168.27,69.05 167,67.78 167,64.61 168.27,63.34 168.27,62.7 IC22.16 168.27,60.16 168.27,59.52 167.63,58.89 167.63,53.17 167,52.54 v167,49.37 | 168.27,93.18 168.27,100.8 IC29.16 | v193.67,102.7 193.67,100.8 IC21.18 | v76.83,93.18 76.83,100.8 IC24.29 | v167.63,93.18 168.27,93.18
  Bottom 0.254: v193.67,102.7 172.72,102.7 171.44,103.97 169.54,103.97 168.91,103.34 168.27,103.34 IC29.16 | v76.83,93.18 77.46,93.81 80,93.81 81.27,95.08 128.27,95.08 128.9,94.45 165.73,94.45 167,93.18 v167.63,93.18 | v167,49.37 167.63,48.73 172.08,48.73 173.35,47.46 183.51,47.46 184.14,48.09 194.31,48.09 195.57,46.82 IC17.29
D5  (via drill 0.61)
  Top 0.254: IC21.17 196.21,98.26 196.21,86.83 194.94,85.56 v194.94,80.48 194.94,75.4 194.31,74.77 194.31,44.28 194.94,43.65 IC17.28 | IC22.17 165.73,62.7 165.73,63.34 164.46,64.61 164.46,67.78 165.73,69.05 165.73,80.48 IC23.17 165.73,83.02 165.73,83.66 164.46,84.92 164.46,88.1 165.73,89.37 165.73,100.8 IC29.17 165.73,103.34 v165.73,105.25 | v79.37,95.72 79.37,100.8 IC24.28 | v129.53,105.25 v129.53,96.36
  Bottom 0.254: v79.37,95.72 80,96.36 v129.53,96.36 | v129.53,105.25 130.17,105.88 165.09,105.88 v165.73,105.25 | v194.94,80.48 172.08,80.48 171.44,79.84 166.37,79.84 165.73,80.48 IC23.17
D6  (via drill 0.61)
  Top 0.254: 163.19,91.91 163.19,89.37 161.92,88.1 161.92,84.92 163.19,83.66 163.19,83.02 IC23.18 163.19,80.48 163.19,69.05 161.92,67.78 161.92,64.61 163.19,63.34 163.19,62.7 IC22.18 163.19,60.16 163.19,59.52 162.56,58.89 162.56,48.09 161.92,47.46 v161.92,39.84 | 163.19,91.91 163.19,100.8 IC29.18 | v182.88,39.84 v182.88,42.38 | v198.75,91.91 198.75,98.26 IC21.16 | v162.56,91.91 163.19,91.91 | v88.26,91.28 88.26,85.56 87.62,84.92 86.35,84.92 85.72,85.56 85.72,88.73 84.45,88.73 83.18,90 83.18,93.18 81.91,94.45 81.91,100.8 IC24.27
  Bottom 0.254: v182.88,42.38 183.51,41.74 195.57,41.74 IC17.27 | v161.92,39.84 v182.88,39.84 | 163.82,91.91 v162.56,91.91 | 163.82,91.91 v198.75,91.91 | v88.26,91.28 89.53,92.55 90.16,92.55 90.8,93.18 109.85,93.18 110.48,92.55 112.39,92.55 114.93,90 122.55,90 124.45,91.91 127.63,91.91 128.9,93.18 162.56,93.18 163.82,91.91
D7  (via drill 0.61)
  Top 0.254: IC22.19 160.01,62.06 159.38,62.7 159.38,67.78 160.65,69.05 160.65,80.48 IC23.19 | v184.78,62.7 v184.78,39.84 | v160.65,90.64 160.65,100.8 IC29.19 | IC21.15 201.29,98.26 v201.29,90.64 v201.29,88.1 | v122.55,93.18 116.83,98.89 116.83,105.88 88.26,105.88 85.08,102.7 IC24.26 | v127.63,90.64 v127.63,93.18 | v173.98,62.7 174.62,63.34 174.62,81.75 173.98,82.39 v173.98,88.73
  Bottom 0.254: v184.78,39.84 185.41,39.2 195.57,39.2 IC17.26 | v184.78,62.7 v173.98,62.7 172.72,62.7 172.08,63.34 161.28,63.34 160.65,62.7 IC22.19 | v201.29,90.64 198.75,90.64 198.12,91.28 163.19,91.28 162.56,90.64 v160.65,90.64 160.01,91.28 158.11,91.28 156.84,90 128.27,90 v127.63,90.64 | v127.63,93.18 v122.55,93.18 | v173.98,88.73 174.62,88.1 176.53,88.1 177.16,87.47 200.66,87.47 v201.29,88.1
E  (via drill 0.61)
  Top 0.254: v205.1,67.78 205.1,93.81 203.83,95.08 203.83,98.26 IC21.14 | v111.75,103.34 111.75,92.55 110.48,91.28 110.48,87.47 112.39,85.56 v112.39,84.92 | v125.72,84.29 125.72,80.48 126.99,79.21 126.99,71.59 v126.36,70.95 | v213.35,11.9 213.99,12.54 213.99,27.77 212.09,29.68 213.35,30.95 213.35,55.08 211.45,56.98 v211.45,67.78
  Bottom 0.254: v111.75,103.34 111.12,103.97 87.62,103.97 86.99,103.34 IC24.25 | v112.39,84.92 125.09,84.92 v125.72,84.29 | v126.36,70.95 126.99,70.95 127.63,70.32 128.9,70.32 129.53,69.69 158.75,69.69 160.01,68.41 179.06,68.41 179.7,67.78 190.5,67.78 191.76,66.51 194.94,66.51 IC17.37 196.84,67.14 197.48,67.78 v205.1,67.78 v211.45,67.78 | v213.35,11.9 207.64,11.9 207,11.27 IC18.10
GND  (via drill 0.61)
  Top 0.508: JP3.2 84.45,70.95 v84.45,58.89 83.18,57.62 83.18,48.73 83.81,48.09 83.81,46.82 v83.18,46.19 | v86.99,4.28 86.99,7.46 BYP11.2 86.35,8.09 85.72,8.73 85.72,21.42 | 85.72,21.42 86.35,20.79 BYP12.2 | 85.72,32.85 85.72,21.42 | 85.72,32.85 86.35,33.49 BYP13.2 | v74.29,33.49 74.29,29.68 IC10.12 | 85.72,32.85 85.72,41.74 86.35,42.38 86.35,46.19 BYP14.2 | v13.33,5.55 13.33,7.46 BYP1.2 | v43.81,5.55 43.81,15.08 BYP9.2 43.18,15.71 42.54,16.34 42.54,29.04 43.81,30.31 v43.81,30.95 43.81,37.94 BYP10.2 44.45,38.57 45.08,39.2 45.08,44.92 46.35,46.19 46.35,50.63 BYP26.2 | v38.73,15.71 38.73,16.98 IC2.10 | v59.05,15.71 59.05,19.52 IC9.19 | v15.87,2.38 15.87,4.28 IC1.1 | v38.73,2.38 38.73,4.28 IC1.10 | v13.33,18.25 13.33,20.15 BYP2.2 | v13.33,30.95 13.33,32.85 BYP3.2 | IC2.1 16.5,18.88 16.5,22.7 17.14,23.33 17.14,27.14 15.87,28.41 15.87,29.68 IC3.1 15.87,32.22 15.87,33.49 17.14,34.76 17.14,40.48 15.87,41.74 15.87,42.38 IC4.1 | v13.33,43.65 13.33,45.55 BYP4.2 13.33,46.82 13.33,48.73 14.6,50 14.6,53.17 15.87,54.45 15.87,55.08 IC5.1 | v13.33,56.35 13.33,58.25 BYP5.2 13.33,59.52 13.33,62.06 12.06,63.34 12.06,64.61 13.33,65.88 v13.33,69.05 13.33,70.95 BYP6.2 13.33,72.22 13.33,74.77 12.06,76.03 12.06,77.3 13.33,78.58 v13.33,81.75 13.33,83.66 BYP7.2 13.33,84.92 13.33,86.19 14.6,87.47 14.6,91.28 15.87,92.55 15.87,93.18 IC8.1 | v13.33,94.45 13.33,96.36 BYP8.2 | SV9.9 59.05,62.06 59.05,63.34 SV9.10 | v51.43,51.27 51.43,55.08 IC26.19 51.43,57.62 v51.43,59.52 | BYP24.2 46.35,86.19 v46.35,81.75 46.35,79.21 v45.08,77.94 | v48.89,94.45 48.89,88.1 IC24.1 | v51.43,73.5 51.43,75.4 IC25.19
  Top 0.508: 40,42.38 40.64,41.74 v40.64,38.57 | 40,42.38 39.37,43.02 IC4.10 | v59.05,38.57 59.05,42.38 IC10.19 | 40,55.08 39.37,55.71 IC5.10 | 40,55.08 40,42.38 | 40,55.08 40,67.78 39.37,68.41 IC6.10 | 113.66,16.98 113.66,6.82 113.02,6.18 IC11.10 | 113.66,16.98 113.02,17.61 IC12.10 | 113.66,29.68 113.02,30.31 IC13.10 | 113.66,29.68 113.66,16.98 | 113.66,29.68 113.66,42.38 113.02,43.02 IC14.10 | 113.66,57.62 113.02,56.98 IC15.10 | 113.66,57.62 113.66,67.78 113.02,68.41 IC16.10 | 136.52,56.98 136.52,62.7 134.62,64.61 134.62,76.67 BYP23.2 | 136.52,56.98 135.88,56.35 BYP22.2 | v115.56,43.65 115.56,45.55 113.66,47.46 113.66,57.62 | C6.2 183.51,6.18 183.51,7.46 C4.2 | v186.05,8.09 186.05,10 C5.2 | JP1.1 198.75,4.28 198.75,4.92 IC18.7 200.02,5.55 200.66,6.18 200.66,7.46 201.29,8.09 201.29,25.23 IC19.8 | v191.13,5.55 191.13,3.64 C3.2 | BYP17.2 196.21,23.96 196.21,25.23 IC17.21 | 203.83,57.62 202.56,56.35 IC28.5 | 203.83,57.62 203.83,70.95 C1.1 | 203.83,57.62 203.83,51.91 203.19,51.27 203.19,49.37 202.56,48.73 IC28.8 | v205.1,25.87 v205.1,48.73 | C7.2 141.6,21.42 141.6,22.7 C11.2 142.23,23.33 142.87,23.96 142.87,29.68 141.6,30.95 141.6,32.22 IC20.15 | v171.44,8.09 170.81,8.73 170.81,25.23 BYP27.2 170.81,26.5 v170.81,35.39 170.81,44.92 IC22.14 171.44,46.82 171.44,49.37 172.08,50 172.08,62.7 171.44,63.34 171.44,63.97 170.81,64.61 170.81,65.24 IC23.14 171.44,67.14 171.44,73.5 v172.08,74.13 | v136.52,103.97 136.52,97.62 135.88,96.99 BYP29.2 | IC21.23 180.97,98.26 180.97,88.73 178.43,86.19 178.43,85.56 IC21.1 178.43,83.02 178.43,75.4 179.7,74.13 IC17.1 | v172.08,104.61 172.08,100.16 171.44,99.53 171.44,87.47 IC29.14
  Top 0.508: v136.52,35.39 136.52,56.98 | v41.91,105.25 v41.91,98.26 | v119.38,105.25 119.38,103.97 123.19,100.16 128.27,100.16 v128.27,101.44
  Bottom 0.508: v84.45,58.89 86.35,58.89 BYP15.2 | IC25.10 71.75,70.32 73.02,71.59 83.18,71.59 JP3.2 85.72,71.59 86.35,71.59 BYP16.2 | v86.99,4.28 86.35,4.92 74.92,4.92 IC9.12 | v74.29,33.49 86.35,33.49 BYP13.2 | BYP14.2 86.35,46.19 v83.18,46.19 81.91,46.19 80,48.09 72.38,48.09 IC26.10 71.75,47.46 70.48,46.19 61.59,46.19 60.96,45.55 59.69,45.55 59.05,44.92 IC10.19 | v13.33,5.55 15.24,5.55 IC1.1 | v43.81,5.55 39.37,5.55 IC1.10 | v38.73,15.71 43.18,15.71 BYP9.2 44.45,15.71 v59.05,15.71 | v15.87,2.38 16.5,1.74 38.1,1.74 v38.73,2.38 | v13.33,18.25 15.24,18.25 IC2.1 | v13.33,30.95 15.24,30.95 IC3.1 | v13.33,43.65 15.24,43.65 IC4.1 | v13.33,56.35 15.24,56.35 IC5.1 | v13.33,94.45 15.24,94.45 IC8.1 | v13.33,69.05 15.24,69.05 IC6.1 | v13.33,81.75 15.24,81.75 IC7.1 | v51.43,51.27 46.98,51.27 BYP26.2 | v51.43,59.52 52.07,60.16 58.41,60.16 59.05,60.8 SV9.9 | v46.35,81.75 39.37,81.75 IC7.10 | IC24.1 48.26,86.83 46.98,86.83 BYP24.2 | v48.89,94.45 39.37,94.45 IC8.10 | 39.37,70.95 40,71.59 45.72,71.59 BYP25.2 46.98,71.59 49.53,71.59 v51.43,73.5 | 39.37,70.95 38.73,70.32 IC6.10 | v43.81,30.95 39.37,30.95 IC3.10 | v40.64,38.57 43.18,38.57 BYP10.2 44.45,38.57 v59.05,38.57 | v45.08,77.94 45.72,78.58 50.8,78.58 51.43,77.94 IC25.19 | 39.37,70.95 29.2,70.95 28.57,71.59 13.97,71.59 BYP6.2 | BYP22.2 134.62,56.35 113.02,56.35 IC15.10 | v115.56,43.65 113.02,43.65 IC14.10 | v186.05,8.09 184.14,8.09 C4.2 183.51,7.46 179.7,7.46 179.06,6.82 173.35,6.82 172.08,8.09 v171.44,8.09 169.54,8.09 IC27.7 | IC18.7 197.48,5.55 196.84,5.55 BYP18.2 195.57,5.55 v191.13,5.55 184.14,5.55 C6.2 | IC17.21 197.48,25.87 198.12,25.87 BYP19.2 199.38,25.87 200.02,25.87 IC19.8 202.56,25.87 v205.1,25.87
  Bottom 0.508: BYP28.2 199.38,48.73 200.02,48.73 IC28.8 202.56,48.73 v205.1,48.73 | C2.2 201.92,71.59 203.19,71.59 C1.1 | BYP20.2 139.69,20.79 140.97,20.79 C7.2 | 142.23,35.39 141.6,34.76 IC20.15 | 153.66,35.39 142.23,35.39 | 153.66,35.39 154.3,34.76 IC20.10 | v170.81,35.39 153.66,35.39 | v172.08,74.13 179.7,74.13 IC17.1 | IC21.1 177.79,84.29 176.53,84.29 BYP21.2 175.25,84.29 172.08,84.29 170.81,85.56 IC29.14 | v172.08,104.61 168.91,104.61 R13.1 167.63,104.61 167,104.61 166.37,103.97 165.09,103.97 163.82,105.25 136.52,105.25 v136.52,103.97 130.81,103.97 v128.27,101.44 | 142.23,35.39 v136.52,35.39 | v41.91,98.26 38.1,98.26 36.83,96.99 13.97,96.99 BYP8.2 | v41.91,105.25 42.54,105.88 62.23,105.88 62.86,105.25 v119.38,105.25
IN00
  Bottom 0.254: IC9.1 46.98,6.18 48.26,7.46 75.56,7.46 76.83,6.18 88.89,6.18 IC11.1
IN01
  Top 0.254: IC9.2 49.53,4.92 52.7,1.74 90.8,1.74 90.8,15.08 89.53,16.34 89.53,16.98 IC12.1
IN02
  Top 0.254: IC9.3 52.07,4.92 54.61,2.38 88.26,2.38 88.26,28.41 89.53,29.68 IC13.1
IN03  (via drill 0.61)
  Top 0.254: v53.97,10 53.97,6.82 IC9.4 | v80,10.63 80,43.02 v80.64,43.65
  Bottom 0.254: v53.97,10 54.61,9.36 74.92,9.36 75.56,10 78.1,10 78.73,10.63 v80,10.63 | v80.64,43.65 88.89,43.65 IC14.1
IN04  (via drill 0.61)
  Top 0.254: v83.18,3.64 83.18,13.17 83.81,13.81 83.81,25.23 83.18,25.87 83.18,30.95 82.55,31.58 v82.55,44.92 | v90.8,46.19 90.8,53.17 90.16,53.81 90.16,55.71 IC15.1
  Bottom 0.254: v83.18,3.64 82.55,3.01 57.78,3.01 56.51,4.28 IC9.5 | v82.55,44.92 88.26,44.92 89.53,46.19 v90.8,46.19
IN05  (via drill 0.61)
  Top 0.254: v59.05,14.44 59.05,6.82 IC9.6 | v65.4,14.44 65.4,50 67.94,52.54 v67.94,53.81 | v88.26,53.81 88.26,65.88 89.53,67.14 89.53,67.78 IC16.1
  Bottom 0.254: v59.05,14.44 v65.4,14.44 | v67.94,53.81 68.57,53.17 87.62,53.17 v88.26,53.81
MR
  Top 0.254: IC17.3 181.6,69.69 183.51,71.59 183.51,76.03 R8.1
N$1
  Bottom 0.254: IC12.3 95.24,17.61 96.52,16.34 114.93,16.34 116.83,18.25 IN1-2.10
N$2  (via drill 0.61)
  Top 0.254: v98.42,3.64 98.42,15.08 97.78,15.71 97.78,17.61 IC12.4 | v121.91,6.18 121.91,18.88 v122.55,19.52
  Bottom 0.254: v98.42,3.64 103.5,3.64 104.77,2.38 119.38,2.38 120.64,3.64 120.64,6.18 v121.91,6.18 | v122.55,19.52 119.38,19.52 118.74,20.15 117.47,20.15 IN1-2.12
N$3
  Bottom 0.254: Q1.1 208.28,71.59 207,72.86 198.75,72.86 197.48,71.59 IC17.39 195.57,72.22 194.31,72.22 194.31,74.77 194.94,75.4 199.38,75.4 200.66,76.67 C2.1
N$4
  Bottom 0.254: IC17.38 197.48,69.05 208.28,69.05 213.99,74.77 213.99,76.03 208.91,76.03 Q1.2 208.28,76.67 204.47,76.67 C1.2
N$5
  Top 0.254: IC25.2 51.43,70.32 50.8,70.95 50.8,72.86 50.16,73.5 50.16,79.21 51.43,80.48 51.43,85.56 IC24.2
N$6
  Top 0.254: IC18.5 198.12,11.27 198.12,12.54 IC18.4 198.12,13.81 198.12,15.08 IC18.3
N$7  (via drill 0.61)
  Top 0.254: v104.77,22.06 104.77,19.52 IC12.7
  Bottom 0.254: v104.77,22.06 107.94,22.06 109.21,23.33 116.83,23.33 IN1-2.14
N$8  (via drill 0.61)
  Top 0.254: v107.94,23.33 107.94,18.88 IC12.8
  Bottom 0.254: v107.94,23.33 108.58,23.96 114.3,23.96 116.2,25.87 116.83,25.87 IN1-2.16
N$9  (via drill 0.61)
  Top 0.254: v108.58,15.08 108.58,6.82 107.94,6.18 IC11.8
  Bottom 0.254: v108.58,15.08 109.21,15.71 116.83,15.71 IN1-2.8
N$10  (via drill 0.61)
  Top 0.254: v115.56,7.46 115.56,11.9 116.83,13.17 IN1-2.6
  Bottom 0.254: v115.56,7.46 105.41,7.46 104.77,6.82 IC11.7
N$11
  Bottom 0.254: IC11.4 97.15,4.28 97.15,2.38 95.24,2.38 93.34,4.28 93.34,10.63 116.83,10.63 IN1-2.4
N$12
  Bottom 0.254: IC11.3 94.61,6.82 95.88,8.09 114.93,8.09 115.56,8.73 117.47,8.73 IN1-2.2
N$13  (via drill 0.61)
  Top 0.254: v107.31,9.36 107.31,11.9 IC11.13
  Bottom 0.254: v107.31,9.36 118.1,9.36 118.74,8.73 120.01,8.73 IN1-2.1
N$14  (via drill 0.61)
  Top 0.254: v106.04,3.64 106.04,6.82 104.77,8.09 104.77,11.9 IC11.14 | v118.74,3.64 118.74,8.73 119.38,9.36 120.01,9.36 120.01,10 IN1-2.3
  Bottom 0.254: v106.04,3.64 v118.74,3.64
N$15
  Bottom 0.254: IC11.17 97.78,12.54 99.05,11.27 116.2,11.27 116.83,11.9 118.1,11.9 119.38,13.17 IN1-2.5
N$16  (via drill 0.61)
  Top 0.254: v123.19,7.46 v123.19,15.71 | v114.3,5.55 113.66,5.55 113.66,4.28 111.12,1.74 103.5,1.74 103.5,6.82 104.13,7.46 104.13,11.27 103.5,11.9 v103.5,15.08
  Bottom 0.254: v123.19,15.71 120.64,15.71 IN1-2.7 | v123.19,7.46 121.91,7.46 121.28,6.82 120.01,6.82 118.74,5.55 v114.3,5.55 | v103.5,15.08 102.86,15.71 95.88,15.71 94.61,14.44 IC11.18
N$17  (via drill 0.61)
  Top 0.254: v109.21,20.79 109.21,23.96 107.94,25.23 IC12.13
  Bottom 0.254: v109.21,20.79 109.85,20.15 116.2,20.15 116.83,19.52 118.1,19.52 118.74,18.88 120.01,18.88 IN1-2.9
N$18  (via drill 0.61)
  Top 0.254: v120.64,2.38 120.64,6.18 121.28,6.82 121.28,20.15 120.64,20.79 IN1-2.11 | v100.96,2.38 100.96,8.73 v101.59,9.36 | v106.04,9.36 106.04,19.52 105.41,20.15 105.41,21.42 106.04,22.06 106.04,22.7 104.77,23.96 104.77,24.6 IC12.14
  Bottom 0.254: v120.64,2.38 120.01,1.74 101.59,1.74 v100.96,2.38 | v101.59,9.36 v106.04,9.36
N$19
  Bottom 0.254: IC12.17 97.78,25.23 102.23,20.79 107.94,20.79 109.21,22.06 118.1,22.06 119.38,23.33 IN1-2.13
N$20
  Bottom 0.254: IC12.18 95.24,26.5 96.52,27.77 117.47,27.77 119.38,25.87 IN1-2.15
N$21
  Top 0.254: R1.1 196.84,20.79 197.48,20.79 IC18.1
  Bottom 0.254: C3.1 190.5,13.17 189.22,14.44 174.62,14.44 173.98,15.08 173.98,19.52 191.13,19.52 192.4,20.79 195.57,20.79 R1.1
N$22
  Top 0.254: IC18.2 197.48,18.25 196.84,18.25 R2.1 196.21,17.61 194.94,16.34 194.94,4.28 195.57,3.64 JP1.2
N$23  (via drill 0.61)
  Top 0.254: IC21.3 184.14,83.66 185.41,83.66 IC21.4 186.05,85.56 186.05,88.1 194.94,96.99 194.94,101.44 196.84,101.44 197.48,100.8 197.48,98.26 196.84,97.62 196.84,88.73 200.02,85.56 200.02,82.39 198.75,81.11 198.75,66.51 200.02,65.24 199.38,64.61 199.38,55.08 202.56,55.08 203.19,54.45 203.19,52.54 200.02,52.54 199.38,51.91 199.38,51.27 v198.75,50.63 | v193.67,11.9 193.67,19.52 193.03,20.15 193.03,31.58 192.4,32.22 192.4,36.03 193.03,36.66 193.03,49.37 v192.4,50
  Bottom 0.254: v193.67,11.9 169.54,11.9 168.91,12.54 IC27.5 | v192.4,50 198.12,50 v198.75,50.63
N$24  (via drill 0.61)
  Top 0.254: v52.7,40.48 52.7,47.46 52.07,48.09 IC26.2 | v55.24,37.3 v55.24,40.48 | v74.29,37.3 74.92,37.94 74.92,41.74 76.19,43.02 76.19,59.52 75.56,60.16 75.56,81.11 71.75,84.92 71.75,85.56 IC24.10
  Bottom 0.254: v55.24,40.48 v52.7,40.48 | v55.24,37.3 v74.29,37.3
N$25  (via drill 0.61)
  Top 0.254: v74.29,90 74.29,88.1 IC24.11 | v78.1,90 78.1,84.92 81.27,81.75 81.27,56.35 80,55.08 80,45.55 81.91,43.65 v81.91,30.95 | v53.97,51.91 53.97,50 IC26.3
  Bottom 0.254: v78.1,90 v74.29,90 | v81.91,30.95 59.05,30.95 58.41,31.58 50.8,31.58 50.16,32.22 45.08,32.22 41.91,35.39 36.83,35.39 34.92,37.3 34.92,41.74 39.37,41.74 43.18,45.55 45.08,45.55 46.35,46.82 46.35,48.09 44.45,50 44.45,52.54 53.34,52.54 v53.97,51.91
N$26
  Top 0.254: IC5.2 18.41,61.43 17.14,62.7 17.14,78.58 18.41,79.84 | 8.25,83.02 8.25,79.21 6.98,77.94 6.98,60.8 8.25,59.52 OUT5-6.2
  Bottom 0.254: IC5.2 16.5,54.45 9.52,54.45 5.71,58.25 5.71,67.78 8.89,67.78 9.52,67.14 9.52,62.7 7.62,62.7 6.98,62.06 6.98,59.52 8.25,59.52 OUT5-6.2
N$27
  Top 0.254: IC27.6 167.63,11.27 165.73,13.17 165.73,16.98 R11.A 166.37,18.88 167.63,20.15 IC27.2
  Bottom 0.254: C6.1 177.79,5.55 176.53,4.28 171.44,4.28 168.91,6.82 167,6.82 166.37,7.46 166.37,10.63 167,10.63 IC27.6
N$28
  Top 0.254: IC27.1 168.91,22.7 170.17,21.42 170.17,6.82 168.91,5.55 R9.1
  Bottom 0.254: R9.1 168.91,5.55 171.44,3.01 175.25,3.01 R10.2
N$29
  Bottom 0.254: IC14.3 95.24,43.02 96.52,41.74 114.93,41.74 116.83,43.65 IN3-4.10
N$30  (via drill 0.61)
  Top 0.254: v112.39,81.75 113.66,80.48 113.66,69.05 114.3,68.41 114.3,48.09 116.2,46.19 116.83,46.19 IN3-4.12 | v82.55,47.46 v82.55,84.29 | v97.15,47.46 97.15,44.92 IC14.4
  Bottom 0.254: v112.39,81.75 93.97,81.75 93.34,82.39 86.35,82.39 85.72,83.02 83.81,83.02 v82.55,84.29 | v82.55,47.46 v97.15,47.46
N$31  (via drill 0.61)
  Top 0.254: v104.77,47.46 104.77,44.92 IC14.7
  Bottom 0.254: v104.77,47.46 107.94,47.46 109.21,48.73 116.83,48.73 IN3-4.14
N$32  (via drill 0.61)
  Top 0.254: v107.94,48.73 107.94,44.28 IC14.8
  Bottom 0.254: v107.94,48.73 108.58,49.37 114.3,49.37 116.2,51.27 116.83,51.27 IN3-4.16
N$33  (via drill 0.61)
  Top 0.254: v37.46,28.41 37.46,33.49 36.19,34.76 36.19,37.3 IC3.12 | v12.06,27.14 10.79,28.41 10.79,31.58 OUT3-4.1
  Bottom 0.254: v37.46,28.41 19.68,28.41 19.04,27.77 12.7,27.77 v12.06,27.14
N$34  (via drill 0.61)
  Top 0.254: v14.6,35.39 14.6,34.76 11.43,34.76 OUT3-4.3 | v28.57,36.03 28.57,37.3 IC3.15
  Bottom 0.254: v14.6,35.39 15.24,36.03 v28.57,36.03
N$35
  Bottom 0.254: IC3.16 25.39,37.94 24.12,36.66 10.79,36.66 OUT3-4.5
N$36
  Bottom 0.254: IC3.19 17.77,39.2 16.5,40.48 10.79,40.48 OUT3-4.7
N$37
  Bottom 0.254: IC13.3 95.24,30.31 96.52,29.04 102.86,29.04 103.5,29.68 103.5,34.76 106.04,34.76 107.31,33.49 116.83,33.49 IN3-4.2
N$38
  Bottom 0.254: IC13.4 97.78,31.58 102.23,36.03 116.83,36.03 IN3-4.4
N$39  (via drill 0.61)
  Top 0.254: v116.2,29.04 115.56,29.68 115.56,37.3 116.83,38.57 IN3-4.6
  Bottom 0.254: v116.2,29.04 114.93,30.31 114.3,30.31 113.02,29.04 105.41,29.04 104.77,29.68 IC13.7
N$40  (via drill 0.61)
  Top 0.254: v108.58,40.48 108.58,33.49 107.94,32.85 107.94,31.58 IC13.8
  Bottom 0.254: v108.58,40.48 109.21,41.11 116.83,41.11 IN3-4.8
N$41  (via drill 0.61)
  Top 0.254: v106.04,45.55 106.04,51.27 106.67,51.91 IC14.13
  Bottom 0.254: v106.04,45.55 113.02,45.55 113.66,44.92 118.1,44.92 118.74,44.28 120.01,44.28 IN3-4.9
N$42  (via drill 0.61)
  Top 0.254: v126.99,62.7 v126.99,46.19 | v106.04,61.43 106.04,52.54 105.41,51.91 IC14.14
  Bottom 0.254: v126.99,46.19 120.64,46.19 IN3-4.11 | v126.99,62.7 116.83,62.7 115.56,61.43 v106.04,61.43
N$43  (via drill 0.61)
  Top 0.254: v122.55,48.73 123.19,49.37 123.19,56.98 124.45,58.25 124.45,78.58 v125.09,79.21 | v100.96,80.48 98.42,77.94 98.42,72.86 95.88,70.32 95.88,55.08 97.15,53.81 97.15,52.54 IC14.17
  Bottom 0.254: v122.55,48.73 120.64,48.73 IN3-4.13 | v125.09,79.21 123.82,80.48 121.28,80.48 120.64,79.84 107.31,79.84 106.04,81.11 101.59,81.11 v100.96,80.48
N$44
  Bottom 0.254: IC14.18 95.24,51.91 96.52,53.17 117.47,53.17 119.38,51.27 IN3-4.15
N$45  (via drill 0.61)
  Top 0.254: v107.31,34.76 107.31,37.3 IC13.13
  Bottom 0.254: v107.31,34.76 118.1,34.76 118.74,34.12 120.01,34.12 IN3-4.1
N$46  (via drill 0.61)
  Top 0.254: v104.77,33.49 104.77,37.3 IC13.14 | v118.74,32.22 118.74,34.12 119.38,34.76 120.01,34.76 120.01,35.39 IN3-4.3
  Bottom 0.254: v104.77,33.49 105.41,32.85 116.2,32.85 116.83,32.22 v118.74,32.22
N$47
  Bottom 0.254: IC13.17 97.78,37.94 99.05,36.66 116.2,36.66 116.83,37.3 118.1,37.3 119.38,38.57 IN3-4.5
N$48  (via drill 0.61)
  Top 0.254: v124.45,41.11 124.45,53.17 v125.09,53.81 | v93.34,53.17 93.34,41.11 93.97,40.48 93.97,39.2 IC13.18
  Bottom 0.254: v124.45,41.11 120.64,41.11 IN3-4.7 | v125.09,53.81 111.12,53.81 110.48,54.45 97.78,54.45 97.15,53.81 93.97,53.81 v93.34,53.17
N$49
  Bottom 0.254: IC3.5 25.39,31.58 24.12,32.85 14.6,32.85 13.97,32.22 12.7,32.22 11.43,33.49 10.16,33.49 8.89,34.76 OUT3-4.4
N$50  (via drill 0.61)
  Top 0.254: v6.34,27.77 v6.34,37.3
  Bottom 0.254: v6.34,27.77 8.25,27.77 8.89,28.41 18.41,28.41 19.04,29.04 27.93,29.04 28.57,29.68 IC3.6 | v6.34,37.3 7.62,37.3 OUT3-4.6
N$51  (via drill 0.61)
  Top 0.254: v8.25,29.04 8.25,31.58 OUT3-4.2
  Bottom 0.254: v8.25,29.04 17.77,29.04 18.41,29.68 IC3.2
N$52
  Bottom 0.254: IC3.9 35.55,31.58 33.02,34.12 14.6,34.12 12.7,36.03 6.34,36.03 3.8,38.57 3.8,39.84 7.62,39.84 OUT3-4.8
N$53
  Bottom 0.254: IC1.12 36.83,12.54 40.64,8.73 75.56,8.73 76.19,9.36 88.26,9.36 90.8,6.82 90.8,2.38 46.98,2.38 45.08,4.28 45.08,7.46 36.19,7.46 34.92,8.73 25.39,8.73 24.76,9.36 12.7,9.36 11.43,8.09 OUT1-2.1
N$54
  Bottom 0.254: IC1.15 27.93,12.54 26.03,10.63 11.43,10.63 OUT1-2.3
N$55
  Top 0.254: IC1.16 26.03,11.9 25.39,11.27 25.39,7.46 24.76,6.82 24.76,4.28 24.12,3.64 19.68,3.64 19.68,6.82 17.14,9.36 12.06,9.36 12.06,11.27 10.79,12.54 OUT1-2.5
N$56
  Bottom 0.254: IC1.19 17.77,13.81 15.87,15.71 11.43,15.71 OUT1-2.7
N$57
  Top 0.254: IC1.2 17.77,6.18 16.5,7.46 14.6,7.46 14.6,5.55 13.33,4.28 8.25,4.28 8.25,7.46 OUT1-2.2
N$58  (via drill 0.61)
  Top 0.254: v7.62,3.64 7.62,6.18 6.98,6.82 6.98,10 7.62,10.63 OUT1-2.4
  Bottom 0.254: v7.62,3.64 25.39,3.64 26.03,4.28 IC1.5
N$59  (via drill 0.61)
  Top 0.254: v28.57,10.63 28.57,6.82 IC1.6 | v19.68,15.08 19.68,11.9 17.77,10 12.7,10 12.7,11.9 12.06,12.54 v12.06,14.44
  Bottom 0.254: v28.57,10.63 29.84,11.9 29.84,15.08 v19.68,15.08 | v12.06,14.44 9.52,14.44 8.89,13.81 8.25,13.81 OUT1-2.6
N$60  (via drill 0.61)
  Top 0.254: v9.52,6.82 9.52,13.81 8.89,14.44 8.25,14.44 8.25,15.08 OUT1-2.8
  Bottom 0.254: v9.52,6.82 13.97,6.82 15.87,8.73 24.12,8.73 25.39,7.46 34.92,7.46 35.55,6.82 36.19,6.82 IC1.9
N$61
  Bottom 0.254: IC2.19 17.77,25.23 16.5,23.96 13.33,23.96 11.43,25.87 OUT1-2.15
N$62
  Bottom 0.254: IC2.16 25.39,25.23 23.49,23.33 11.43,23.33 OUT1-2.13
N$63  (via drill 0.61)
  Top 0.254: v28.57,22.06 28.57,24.6 IC2.15
  Bottom 0.254: v28.57,22.06 12.7,22.06 12.06,21.42 10.79,21.42 OUT1-2.11
N$64
  Top 0.254: IC2.12 36.83,26.5 41.91,31.58 41.91,39.2 41.27,39.84 41.27,42.38 40.64,43.02 40.64,104.61 39.37,105.88 7.62,105.88 7.62,103.34 6.98,102.7 6.98,102.07 1.27,96.36 1.27,23.33 5.08,19.52 10.79,19.52 10.79,18.88 OUT1-2.9
N$65
  Bottom 0.254: IC2.2 17.77,17.61 16.5,16.34 12.06,16.34 11.43,16.98 10.16,16.98 8.89,18.25 OUT1-2.10
N$66
  Bottom 0.254: IC2.5 26.66,17.61 27.93,16.34 29.2,16.34 29.84,16.98 29.84,23.33 24.76,23.33 24.12,22.7 12.06,22.7 11.43,22.06 10.16,22.06 8.89,20.79 OUT1-2.12
N$67
  Bottom 0.254: IC2.6 27.93,18.88 26.66,20.15 14.6,20.15 13.97,19.52 7.62,19.52 6.98,20.15 6.98,23.33 7.62,23.33 OUT1-2.14
N$68  (via drill 0.61)
  Top 0.254: v18.41,15.71 14.6,15.71 12.06,18.25 12.06,23.96 11.43,24.6 10.16,24.6 8.89,25.87 OUT1-2.16 | v36.19,15.71 36.19,16.98 IC2.9
  Bottom 0.254: v18.41,15.71 19.04,16.34 19.68,16.34 20.31,15.71 v36.19,15.71
N$69
  Bottom 0.254: IC4.2 18.41,42.38 17.14,41.11 10.16,41.11 8.89,42.38 OUT3-4.10
N$70  (via drill 0.61)
  Top 0.254: v6.34,43.65 6.98,43.02 6.98,41.74 7.62,41.11 12.7,41.11 v12.7,42.38
  Bottom 0.254: v6.34,43.65 7.62,43.65 8.25,44.28 OUT3-4.12 | v12.7,42.38 13.33,41.74 16.5,41.74 17.14,42.38 17.14,45.55 25.39,45.55 26.03,44.92 IC4.5
N$71  (via drill 0.61)
  Top 0.254: v3.17,30.31 v3.17,46.82 | v12.06,30.31 13.97,28.41 13.97,27.77 14.6,27.14 14.6,16.98 15.24,16.34 17.14,16.34 17.14,22.06 19.68,24.6 19.68,27.14 17.14,29.68 17.14,33.49 17.77,34.12 17.77,35.39 19.68,37.3 v19.68,40.48
  Bottom 0.254: v3.17,46.82 3.8,47.46 7.62,47.46 OUT3-4.14 | v12.06,30.31 v3.17,30.31 | v19.68,40.48 20.95,41.74 27.93,41.74 28.57,42.38 IC4.6
N$72  (via drill 0.61)
  Top 0.254: v36.19,48.73 36.19,44.92 IC4.9 | v6.34,46.19 5.08,47.46 v5.08,50
  Bottom 0.254: v36.19,48.73 19.68,48.73 19.04,48.09 13.33,48.09 11.43,46.19 v6.34,46.19 | v5.08,50 7.62,50 OUT3-4.16
N$73
  Bottom 0.254: IC4.19 17.77,50.63 16.5,49.37 10.79,49.37 OUT3-4.15
N$74  (via drill 0.61)
  Top 0.254: v12.06,43.65 12.06,45.55 11.43,46.19 11.43,47.46 OUT3-4.13 | v26.03,46.19 26.03,50 IC4.16
  Bottom 0.254: v12.06,43.65 13.33,44.92 13.97,44.92 15.24,46.19 v26.03,46.19
N$75  (via drill 0.61)
  Top 0.254: v9.52,48.73 9.52,45.55 10.16,44.92 OUT3-4.11
  Bottom 0.254: v9.52,48.73 18.41,48.73 19.04,49.37 27.93,49.37 28.57,50 IC4.15
N$76  (via drill 0.61)
  Top 0.254: v37.46,58.89 37.46,52.54 36.83,51.91 IC4.12 | v29.84,58.89 27.3,61.43 v27.3,100.16 | v9.52,103.34 9.52,101.44 8.89,100.8 6.98,100.8 1.9,95.72 1.9,49.37 7.62,43.65 8.89,43.65 10.16,42.38 OUT3-4.9
  Bottom 0.254: v29.84,58.89 v37.46,58.89 | v27.3,100.16 27.3,103.97 13.33,103.97 12.06,102.7 11.43,103.34 v9.52,103.34
N$77
  Bottom 0.254: IC16.3 95.24,68.41 96.52,67.14 114.93,67.14 116.83,69.05 IN5-6.10
N$78  (via drill 0.61)
  Top 0.254: v103.5,70.95 v103.5,85.56 | v111.12,85.56 v111.12,72.22
  Bottom 0.254: v103.5,70.95 97.78,70.95 97.15,70.32 IC16.4 | v103.5,85.56 v111.12,85.56 | v111.12,72.22 111.75,71.59 116.83,71.59 IN5-6.12
N$79  (via drill 0.61)
  Top 0.254: v104.77,72.86 104.77,70.32 IC16.7
  Bottom 0.254: v104.77,72.86 107.94,72.86 109.21,74.13 116.83,74.13 IN5-6.14
N$80  (via drill 0.61)
  Top 0.254: v107.94,74.13 107.94,69.69 IC16.8
  Bottom 0.254: v107.94,74.13 108.58,74.77 113.02,74.77 114.93,76.67 116.83,76.67 IN5-6.16
N$81  (via drill 0.61)
  Top 0.254: v37.46,73.5 37.46,65.24 36.83,64.61 IC5.12 | v29.84,78.58 v29.84,74.13 | v5.71,77.3 6.34,76.67 6.34,55.08 8.25,53.17 10.79,53.17 10.79,58.25 OUT5-6.1
  Bottom 0.254: v37.46,73.5 36.83,74.13 v29.84,74.13 | v29.84,78.58 10.79,78.58 10.16,77.94 6.98,77.94 6.34,77.3 v5.71,77.3
N$82
  Bottom 0.254: IC5.15 27.93,63.34 26.03,61.43 11.43,61.43 OUT5-6.3
N$83
  Bottom 0.254: IC5.16 25.39,63.34 24.12,62.06 13.33,62.06 11.43,63.97 OUT5-6.5
N$84
  Bottom 0.254: IC5.19 17.77,64.61 15.87,66.51 11.43,66.51 OUT5-6.7
N$85  (via drill 0.61)
  Top 0.254: v36.19,84.92 36.19,88.1 IC7.12
  Bottom 0.254: v36.19,84.92 35.55,84.29 23.49,84.29 22.86,83.66 14.6,83.66 13.97,83.02 11.43,83.02 10.79,83.66 OUT7-8.1
N$86
  Bottom 0.254: IC7.15 27.93,88.73 26.03,86.83 11.43,86.83 OUT7-8.3
N$87
  Bottom 0.254: IC7.16 25.39,88.73 24.12,87.47 13.33,87.47 11.43,89.37 OUT7-8.5
N$88  (via drill 0.61)
  Top 0.254: v18.41,85.56 18.41,88.1 IC7.19 | v12.06,85.56 12.06,91.28 11.43,91.91 OUT7-8.7
  Bottom 0.254: v12.06,85.56 v18.41,85.56
N$89  (via drill 0.61)
  Top 0.254: v26.03,60.16 26.03,57.62 IC5.5
  Bottom 0.254: v26.03,60.16 25.39,60.8 12.06,60.8 11.43,60.16 8.89,60.16 8.25,60.8 OUT5-6.4
N$90  (via drill 0.61)
  Top 0.254: v9.52,57.62 9.52,62.06 8.89,62.7 8.89,63.97 OUT5-6.6
  Bottom 0.254: v9.52,57.62 11.43,57.62 12.06,58.25 12.06,59.52 12.7,60.16 20.31,60.16 22.22,58.25 27.93,58.25 28.57,57.62 IC5.6
N$91  (via drill 0.61)
  Top 0.254: v45.08,54.45 44.45,53.81 44.45,47.46 v45.08,46.82 | v19.68,47.46 19.68,52.54 17.14,55.08 v17.14,58.25
  Bottom 0.254: v45.08,54.45 36.83,54.45 36.19,55.08 IC5.9 | v45.08,46.82 26.66,46.82 26.03,47.46 v19.68,47.46 | v17.14,58.25 14.6,58.25 13.97,57.62 12.7,57.62 12.06,56.98 10.16,56.98 9.52,56.35 8.89,56.35 6.34,58.89 6.34,66.51 7.62,66.51 OUT5-6.8
N$92  (via drill 0.61)